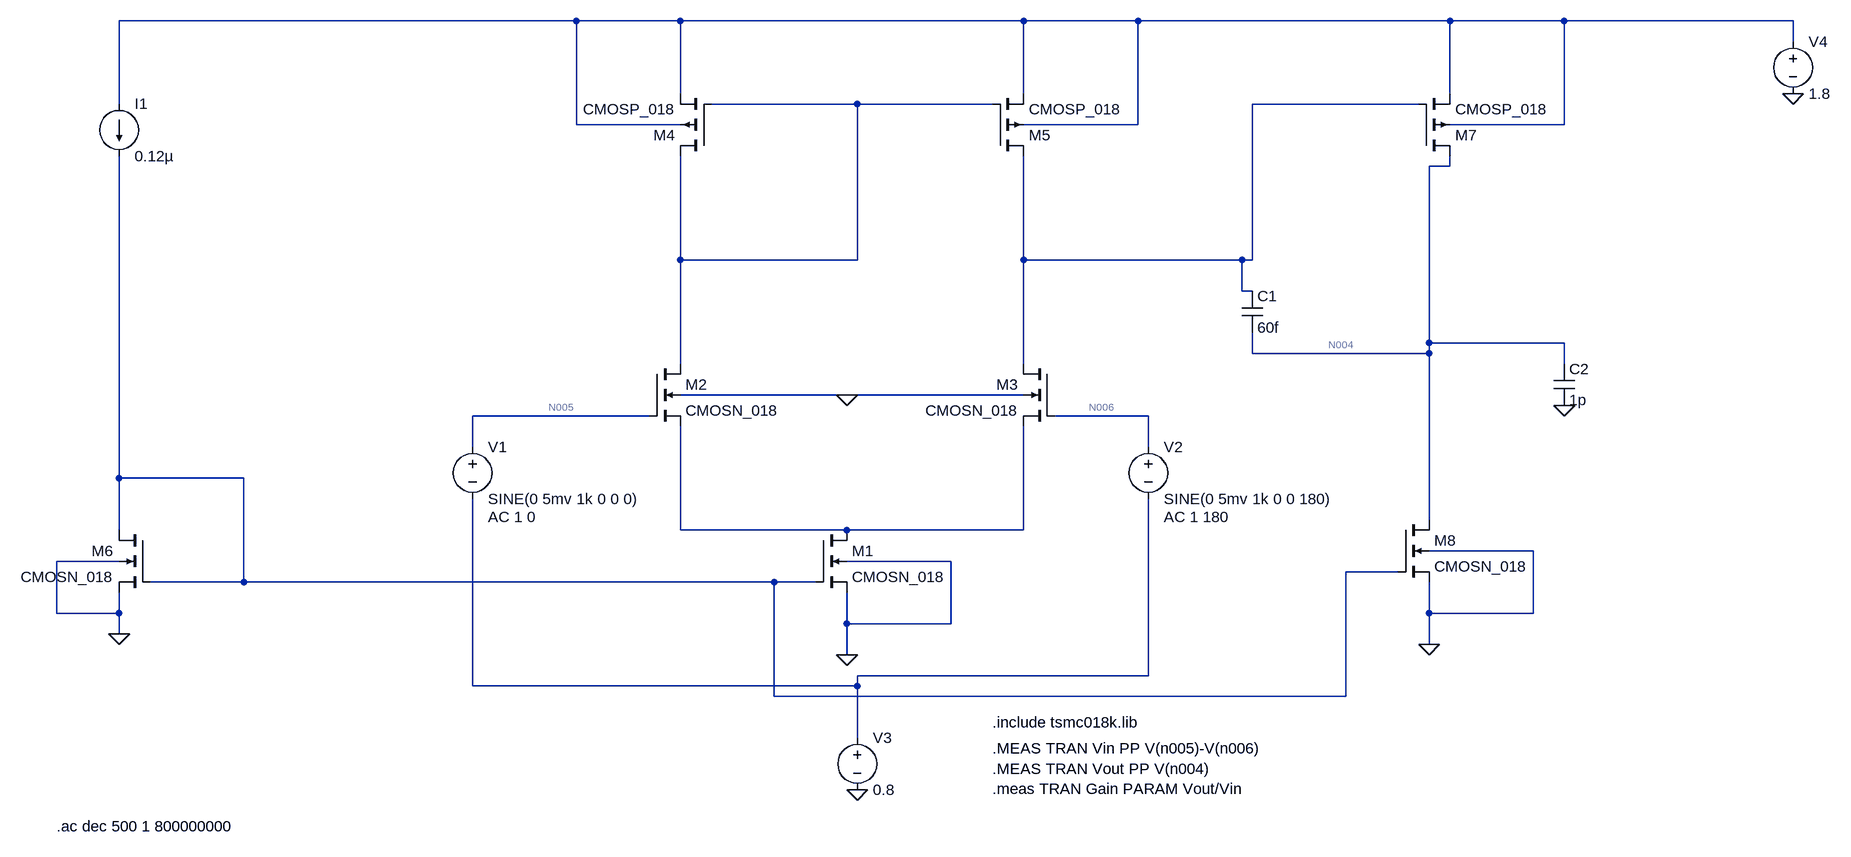
[diagram p0: schematic OTA.asc]
OTA.asc, the LTspice schematic file:
Version 4
SHEET 1 1408 840
WIRE -528 -416 -1232 -416
WIRE -368 -416 -528 -416
WIRE 160 -416 -368 -416
WIRE 336 -416 160 -416
WIRE 816 -416 336 -416
WIRE 992 -416 816 -416
WIRE 1344 -416 992 -416
WIRE 1344 -384 1344 -416
WIRE -368 -304 -368 -416
WIRE 160 -304 160 -416
WIRE 816 -304 816 -416
WIRE -1232 -288 -1232 -416
WIRE -96 -288 -320 -288
WIRE 112 -288 -96 -288
WIRE 768 -288 512 -288
WIRE -528 -256 -528 -416
WIRE -368 -256 -528 -256
WIRE 336 -256 336 -416
WIRE 336 -256 160 -256
WIRE 992 -256 992 -416
WIRE 992 -256 816 -256
WIRE 816 -192 816 -208
WIRE 816 -192 784 -192
WIRE -368 -48 -368 -208
WIRE -96 -48 -96 -288
WIRE -96 -48 -368 -48
WIRE 160 -48 160 -208
WIRE 496 -48 160 -48
WIRE 512 -48 512 -288
WIRE 512 -48 496 -48
WIRE 496 0 496 -48
WIRE 512 0 496 0
WIRE 784 80 784 -192
WIRE 992 80 784 80
WIRE 512 96 512 64
WIRE 784 96 784 80
WIRE 784 96 512 96
WIRE -368 112 -368 -48
WIRE 160 112 160 -48
WIRE 992 112 992 80
WIRE -112 160 -368 160
WIRE 160 160 -112 160
WIRE -416 192 -688 192
WIRE 352 192 208 192
WIRE -688 240 -688 192
WIRE 352 240 352 192
WIRE -1232 288 -1232 -208
WIRE -1040 288 -1232 288
WIRE 784 352 784 96
WIRE -1232 368 -1232 288
WIRE -368 368 -368 208
WIRE -112 368 -368 368
WIRE 160 368 160 208
WIRE 160 368 -112 368
WIRE 944 400 784 400
WIRE -1232 416 -1328 416
WIRE 48 416 -112 416
WIRE 736 432 656 432
WIRE -1040 448 -1040 288
WIRE -1040 448 -1184 448
WIRE -224 448 -1040 448
WIRE -160 448 -224 448
WIRE -1328 496 -1328 416
WIRE -1232 496 -1232 464
WIRE -1232 496 -1328 496
WIRE 784 496 784 448
WIRE 944 496 944 400
WIRE 944 496 784 496
WIRE -112 512 -112 464
WIRE 48 512 48 416
WIRE 48 512 -112 512
WIRE -1232 528 -1232 496
WIRE 784 544 784 496
WIRE -112 560 -112 512
WIRE 352 592 352 320
WIRE 352 592 -96 592
WIRE -688 608 -688 320
WIRE -96 608 -96 592
WIRE -96 608 -688 608
WIRE -224 624 -224 448
WIRE 656 624 656 432
WIRE 656 624 -224 624
WIRE -96 688 -96 608
FLAG -112 560 0
FLAG -1232 528 0
FLAG -96 768 0
FLAG -112 160 0
FLAG 1344 -304 0
FLAG 784 544 0
FLAG 992 176 0
DATAFLAG -528 192 ""
DATAFLAG 816 80 ""
DATAFLAG -112 -288 ""
DATAFLAG 160 -48 ""
DATAFLAG 304 192 ""
DATAFLAG -96 368 ""
DATAFLAG -528 448 ""
DATAFLAG 400 -48 ""
DATAFLAG -368 -48 ""
DATAFLAG -1232 304 ""
SYMBOL cmosn -160 368 R0
SYMATTR InstName M1
SYMATTR Value2 l=0.18u w=0.18u
SYMATTR Value CMOSN_018
SYMBOL cmosn -416 112 R0
SYMATTR InstName M2
SYMATTR Value2 l=0.18u w=.18u
SYMATTR Value CMOSN_018
SYMBOL cmosn 208 112 M0
SYMATTR InstName M3
SYMATTR Value2 l=0.18u w=.18u
SYMATTR Value CMOSN_018
SYMBOL cmosp -320 -208 R180
SYMATTR InstName M4
SYMATTR Value2 l=0.18u w=.54u
SYMATTR Value CMOSP_018
SYMBOL cmosp 112 -208 M180
SYMATTR InstName M5
SYMATTR Value2 l=0.18u w=.54u
SYMATTR Value CMOSP_018
SYMBOL current -1232 -288 R0
WINDOW 123 0 0 Left 0
WINDOW 39 0 0 Left 0
SYMATTR InstName I1
SYMATTR Value 0.12µ
SYMBOL cmosn -1184 368 M0
SYMATTR InstName M6
SYMATTR Value2 l=0.18u w=0.18u
SYMATTR Value CMOSN_018
SYMBOL voltage -96 672 R0
WINDOW 123 0 0 Left 0
WINDOW 39 0 0 Left 0
SYMATTR InstName V3
SYMATTR Value 0.8
SYMBOL voltage 1344 -400 R0
WINDOW 123 0 0 Left 0
WINDOW 39 0 0 Left 0
SYMATTR InstName V4
SYMATTR Value 1.8
SYMBOL cmosp 768 -208 M180
SYMATTR InstName M7
SYMATTR Value2 l=0.18u w=3.6u
SYMATTR Value CMOSP_018
SYMBOL cmosn 736 352 R0
SYMATTR InstName M8
SYMATTR Value2 l=0.18u w=0.18u
SYMATTR Value CMOSN_018
SYMBOL cap 976 112 R0
SYMATTR InstName C2
SYMATTR Value 1p
SYMBOL voltage -688 224 R0
WINDOW 123 24 124 Left 2
WINDOW 39 0 0 Left 0
SYMATTR Value2 AC 1 0
SYMATTR InstName V1
SYMATTR Value SINE(0 5mv 1k 0 0 0)
SYMBOL voltage 352 224 R0
WINDOW 123 24 124 Left 2
WINDOW 39 0 0 Left 0
SYMATTR Value2 AC 1 180
SYMATTR InstName V2
SYMATTR Value SINE(0 5mv 1k 0 0 180)
SYMBOL cap 496 0 R0
SYMATTR InstName C1
SYMATTR Value 60f
TEXT 112 664 Left 2 !.include tsmc018k.lib
TEXT 112 704 Left 2 !.MEAS TRAN Vin PP V(n005)-V(n006)\n.MEAS TRAN Vout PP V(n004)\n.meas TRAN Gain PARAM Vout/Vin
TEXT -1328 824 Left 2 !.ac dec 500 1 800000000

The netlist it stands for:
* OTA.asc
M1 N008 N007 0 0 CMOSN_018 l=0.18u w=0.18u
M2 N002 N005 N008 0 CMOSN_018 l=0.18u w=.18u
M3 N003 N006 N008 0 CMOSN_018 l=0.18u w=.18u
M4 N002 N002 N001 N001 CMOSP_018 l=0.18u w=.54u
M5 N003 N002 N001 N001 CMOSP_018 l=0.18u w=.54u
I1 N001 N007 0.12µ
M6 N007 N007 0 0 CMOSN_018 l=0.18u w=0.18u
V3 N009 0 0.8
V4 N001 0 1.8
M7 N004 N003 N001 N001 CMOSP_018 l=0.18u w=3.6u
M8 N004 N007 0 0 CMOSN_018 l=0.18u w=0.18u
C2 N004 0 1p
V1 N005 N009 SINE(0 5mv 1k 0 0 0) AC 1 0
V2 N006 N009 SINE(0 5mv 1k 0 0 180) AC 1 180
C1 N003 N004 60f
.model NMOS NMOS
.model PMOS PMOS
.lib standard.mos
.include tsmc018k.lib
.MEAS TRAN Vin PP V(n005)-V(n006)
.MEAS TRAN Vout PP V(n004)
.meas TRAN Gain PARAM Vout/Vin
.ac dec 500 1 800000000
.backanno
.end